# Altium schematic sheet 04-Intel_CPLD_1.SchDoc
size A3; SheetNumber: 6; SheetTotal: 7
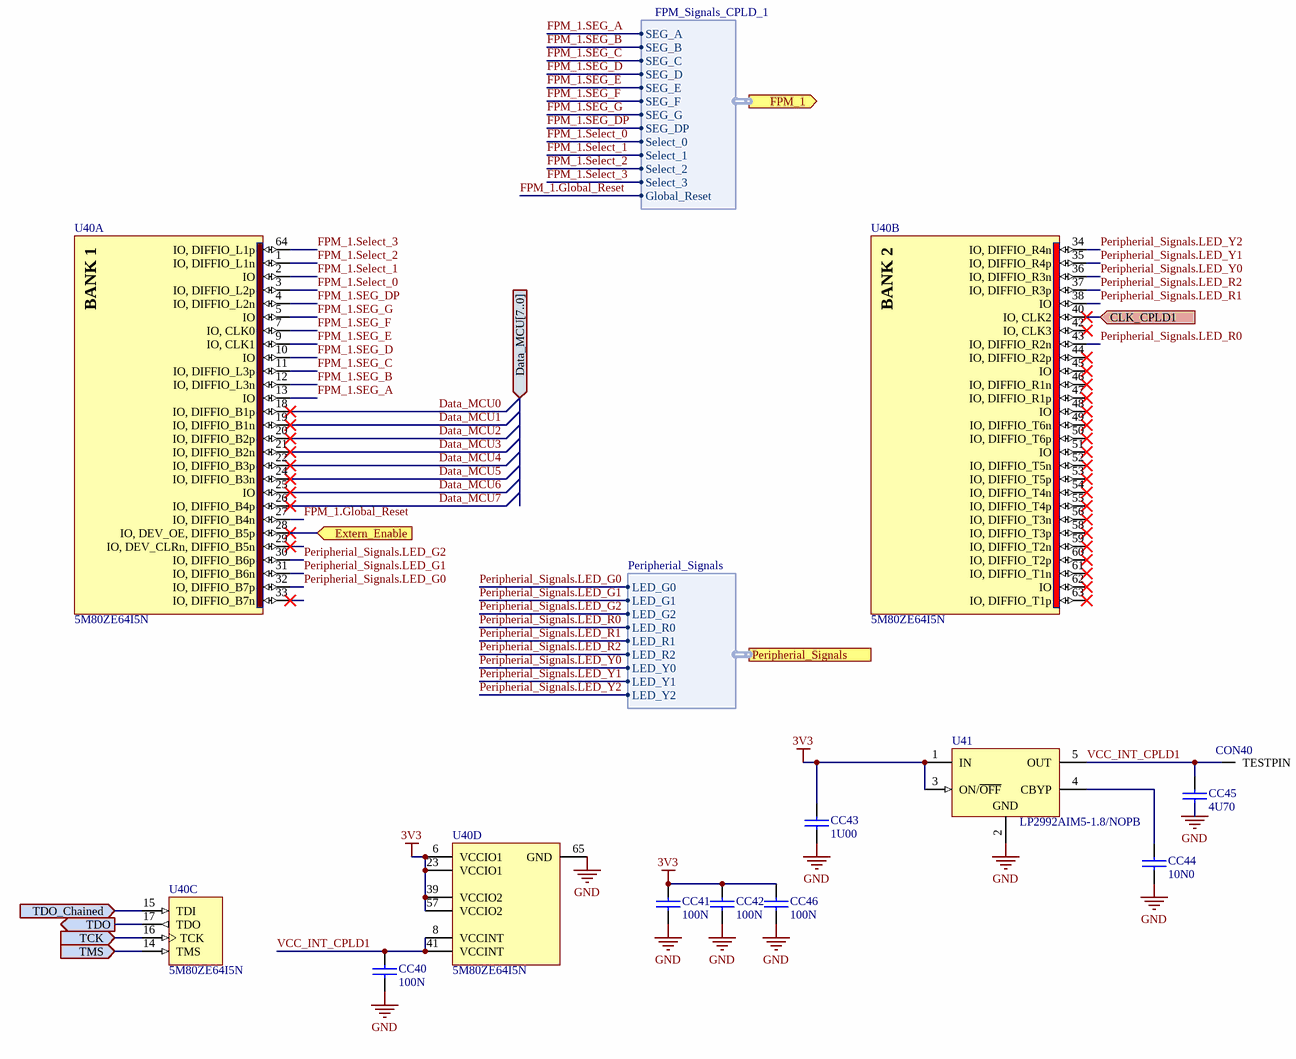
[diagram p0: 04-Intel_CPLD_1.SchDoc]

## Parts
CC40  capacitance: 100N  [0603_C]  (hidden comment: CC)
CC41  capacitance: 100N  [0603_C]  (hidden comment: CC)
CC42  capacitance: 100N  [0603_C]  (hidden comment: CC)
CC43  capacitance: 1U00  [0603_C]  (hidden comment: CC)
CC44  capacitance: 10N0  [0603_C]  (hidden comment: CC)
CC45  capacitance: 4U70  [0603_C]  (hidden comment: CC)
CC46  capacitance: 100N  [0603_C]  (hidden comment: CC)
CON40  CON_001_M_MM000_S_X_MILL-MAX_TP  [CON_001_THT_MM000_S_D]  (value not drawn)
U40  5M80ZE64I5N  [EQFP64_A-120_D2-45_M]  (parts A,B,C,D of 4)
U41  LP2992AIM5-1.8/NOPB  [MF05A_N]

## Ports
CLK_CPLD1 (in), Data_MCU[7..0] (in), Extern_Enable (in), FPM_1 (out, harness FPM_Signals_CPLD_1), Peripherial_Signals (harness Peripherial_Signals), TCK (in), TDO (out), TDO_Chained (in), TMS (in)

## Harnesses
FPM_Signals_CPLD_1: SEG_A, SEG_B, SEG_C, SEG_D, SEG_E, SEG_F, SEG_G, SEG_DP, Select_0, Select_1, Select_2, Select_3, Global_Reset
Peripherial_Signals: LED_G0, LED_G1, LED_G2, LED_R0, LED_R1, LED_R2, LED_Y0, LED_Y1, LED_Y2

## Nets
3V3: CC41.2 CC42.2 CC43.2 CC46.2 U40.6(VCCIO1) U40.23(VCCIO1) U40.39(VCCIO2) U40.57(VCCIO2) U41.1(IN) U41.3(ON/~{OFF})
GND: CC40.1 CC41.1 CC42.1 CC43.1 CC44.1 CC45.1 CC46.1 U40.65(GND) U41.2(GND)
CLK_CPLD1: U40.40(IO,_CLK2) ; port CLK_CPLD1
Data_MCU0: U40.18(IO,_DIFFIO_B1p)
Data_MCU1: U40.19(IO,_DIFFIO_B1n)
Data_MCU2: U40.20(IO,_DIFFIO_B2p)
Data_MCU3: U40.21(IO,_DIFFIO_B2n)
Data_MCU4: U40.22(IO,_DIFFIO_B3p)
Data_MCU5: U40.24(IO,_DIFFIO_B3n)
Data_MCU6: U40.25(IO)
Data_MCU7: U40.26(IO,_DIFFIO_B4p)
Extern_Enable: U40.28(IO,_DEV_OE,_DIFFIO_B5p) ; port Extern_Enable
FPM_1.Global_Reset: U40.27(IO,_DIFFIO_B4n) ; port FPM_1.Global_Reset
FPM_1.SEG_A: U40.13(IO) ; port FPM_1.SEG_A
FPM_1.SEG_B: U40.12(IO,_DIFFIO_L3n) ; port FPM_1.SEG_B
FPM_1.SEG_C: U40.11(IO,_DIFFIO_L3p) ; port FPM_1.SEG_C
FPM_1.SEG_D: U40.10(IO) ; port FPM_1.SEG_D
FPM_1.SEG_DP: U40.4(IO,_DIFFIO_L2n) ; port FPM_1.SEG_DP
FPM_1.SEG_E: U40.9(IO,_CLK1) ; port FPM_1.SEG_E
FPM_1.SEG_F: U40.7(IO,_CLK0) ; port FPM_1.SEG_F
FPM_1.SEG_G: U40.5(IO) ; port FPM_1.SEG_G
FPM_1.Select_0: U40.3(IO,_DIFFIO_L2p) ; port FPM_1.Select_0
FPM_1.Select_1: U40.2(IO) ; port FPM_1.Select_1
FPM_1.Select_2: U40.1(IO,_DIFFIO_L1n) ; port FPM_1.Select_2
FPM_1.Select_3: U40.64(IO,_DIFFIO_L1p) ; port FPM_1.Select_3
Peripherial_Signals.LED_G0: U40.32(IO,_DIFFIO_B7p) ; port Peripherial_Signals.LED_G0
Peripherial_Signals.LED_G1: U40.31(IO,_DIFFIO_B6n) ; port Peripherial_Signals.LED_G1
Peripherial_Signals.LED_G2: U40.30(IO,_DIFFIO_B6p) ; port Peripherial_Signals.LED_G2
Peripherial_Signals.LED_R0: U40.43(IO,_DIFFIO_R2n) ; port Peripherial_Signals.LED_R0
Peripherial_Signals.LED_R1: U40.38(IO) ; port Peripherial_Signals.LED_R1
Peripherial_Signals.LED_R2: U40.37(IO,_DIFFIO_R3p) ; port Peripherial_Signals.LED_R2
Peripherial_Signals.LED_Y0: U40.36(IO,_DIFFIO_R3n) ; port Peripherial_Signals.LED_Y0
Peripherial_Signals.LED_Y1: U40.35(IO,_DIFFIO_R4p) ; port Peripherial_Signals.LED_Y1
Peripherial_Signals.LED_Y2: U40.34(IO,_DIFFIO_R4n) ; port Peripherial_Signals.LED_Y2
TCK: U40.16(TCK) ; port TCK
TDO: U40.17(TDO) ; port TDO
TDO_Chained: U40.15(TDI) ; port TDO_Chained
TMS: U40.14(TMS) ; port TMS
VCC_INT_CPLD1: CC40.2 CC45.2 CON40.1(TESTPIN) U40.8(VCCINT) U40.41(VCCINT) U41.5(OUT)
NetCC44_2: CC44.2 U41.4(CBYP)

Not connected (* = marked no-connect by the designer): U40 29(IO,_DEV_CLRn,_DIFFIO_B5n)* 33(IO,_DIFFIO_B7n)* 42(IO,_CLK3)* 44(IO,_DIFFIO_R2p)* 45(IO)* 46(IO,_DIFFIO_R1n)* 47(IO,_DIFFIO_R1p)* 48(IO)* 49(IO,_DIFFIO_T6n)* 50(IO,_DIFFIO_T6p)* 51(IO)* 52(IO,_DIFFIO_T5n)* 53(IO,_DIFFIO_T5p)* 54(IO,_DIFFIO_T4n)* 55(IO,_DIFFIO_T4p)* 56(IO,_DIFFIO_T3n)* 58(IO,_DIFFIO_T3p)* 59(IO,_DIFFIO_T2n)* 60(IO,_DIFFIO_T2p)* 61(IO,_DIFFIO_T1n)* 62(IO)* 63(IO,_DIFFIO_T1p)*

## Notes on the sheet
- Title:
- Date:
- SVN:
- Ver:
- Sheet Size:
- A3
- Sheet Name:
- OF
- Checked By:
- Drawn By:
- Damian Szczypior
- Rev:
- Alle Rechte vorbehalten. Kopien ohne Erlaubnis der X2E GmbH sind nicht gestattet. Dieses Dokument darf ohne die Erlaubnis der X2E GmbH nicht an Dritte (auch nicht in Auszügen) weitergegeben werden .
- Sheet:
- (in symbol CMP-0217-00123-1, part A) BANK 1
- (in symbol CMP-0217-00123-1, part B) BANK 2

## Library data of the parts
CC40-CC42 CC46 = X_00000681: manufacturer: Yageo; entity_name: CC_0603_100N_50V0_10P0_X7R; entity_type_name: capacitor_ceramic; temp_coefficient: X7R; release: blocked; max_operating_temp: 125C; min_operating_temp: -55C; tolerance: 10P0; voltage_rated: 50V0; ordering_information_btm: 311-1344-6-ND; used_in_bom: 1; production_status: Aktiv; x2e_number: X_00000681; height: mm900; width: mm800; length: 1mm60; package: 0603; series: none
CC43 = X_00001611: manufacturer: Taiyo Yuden; entity_name: CC_0603_1U00_50V0_10P0_X7R; entity_type_name: capacitor_ceramic; temp_coefficient: X7R; release: blocked; max_operating_temp: 125C; min_operating_temp: -55C; tolerance: 10P0; voltage_rated: 50V0; ordering_information_btm: 587-3247-6-ND; used_in_bom: 1; production_status: Aktiv; x2e_number: X_00001611; height: mm800; width: mm800; length: 1mm60; package: 0603; series: M
CC44 = X_00000431: manufacturer: Kemet; entity_name: CC_0603_10N0_50V0_10P0_X7R; entity_type_name: capacitor_ceramic; temp_coefficient: X7R; release: blocked; max_operating_temp: 125C; min_operating_temp: -55C; tolerance: 10P0; voltage_rated: 50V0; ordering_information_btm: 399-1091-6-ND; used_in_bom: 1; production_status: Aktiv; x2e_number: X_00000431; height: mm800; width: mm800; length: 1mm60; package: 0603; series: none
CC45 = X_00002029: manufacturer: Samsung; entity_name: CC_0603_4U70_6V30_10P0_X7R; entity_type_name: capacitor_ceramic; temp_coefficient: X7R; release: blocked; max_operating_temp: 125C; min_operating_temp: -55C; tolerance: 10P0; voltage_rated: 6V30; ordering_information_btm: 1276-2087-6-ND; used_in_bom: 1; production_status: Aktiv; x2e_number: X_00002029; height: mm800; width: mm800; length: 1mm60; package: 0603; series: CL
CON40 = X_00001838: MILL-MAX_TP; ordering_information: digikey, ED90581-ND; entity_type_name: connector; release: blocked; max_operating_temp: 0C; grid: MM000; pin_count_type: X; mounting_type: S; gender: M; number_of_electronic_pins: 001; ordering_information_btm: ED90581-ND; used_in_bom: 1; production_status: Aktiv; editor_date: boos, 06.02.2014; x2e_number: X_00001838; entity_name: CON_001_M_MM000_S_X_MILL-MAX_TP; height: 5mm56; width: 3mm18; length: 3mm18; min_operating_temp: 0C; manufacturer: MILL-MAX; package: THT; shell_material: Tin; series: 2501
U40 = CMP-0217-00123-1: MAX V 1.8V CPLD, 54 IOs, 80 Logic Elements, 64-Pin EQFP, Industrial Temperature, Speed Grade 5, Pb-Free; ComponentLink2URL: http://www.altera.com/literature/hb/max-v/max5_handbook.pdf; ComponentLink4Description: Package Specification; ComponentLink1URL: http://www.altera.com/; ComponentLink1Description: Manufacturer URL; ComponentLink2Description: Datasheet; DatasheetVersion: ver1.2, May-2011; ComponentLink3URL: http://www.altera.com/literature/lit-dp.jsp?category=MAX%205&showspreadsheet=y; ComponentLink4URL: http://www.altera.com/devicepackaging/04R00384-01.pdf; Code_JEDEC: MS-026-ABD-HD; PackageVersion: ver1.0, Jul-2011; PackageDescription: 64-Pin Plastic Enhanced Quad Flat (EQFP) - Wire Bond - A:1.20 - D2:4.5; ComponentLink3Description: MAX V Device Pin-Out files; PackageReference: EQFP64_A-120_D2-45
U41 = CMP-0062-02117-2: Micropower 250 mA Low-Noise Ultra Low-Dropout Regulator, 5-pin SOT-23, Pb-Free; Manufacturer: National Semiconductor; PowerWise: N; PackageTopMarking: LFCA*XTT; CompType: LDO IC; ComponentLink1URL: http://www.national.com/ds/LP/LP2992.pdf; PinCount: 5; PackageReference: MF05A; PackageVersion: revD, Aug-2008; ComponentLink3URL: http://www.national.com/packaging/folders/mf05a.html; DatasheetVersion: May-2005; ComponentLink2URL: http://www.national.com/pf/LP/LP2992.html; RevisionNote: Component URLs added; ComponentLink2Description: LP2992 Web Page; ComponentLink1Description: LP2992 Datasheet; RoHS: Y; PackageDescription: Molded SOT-23, .115 x .063 x .040 in Body, 5 Lead, .0375 in Pitch; ComponentLink3Description: MF05A Package Page